# Altium project Hall.PrjPcb
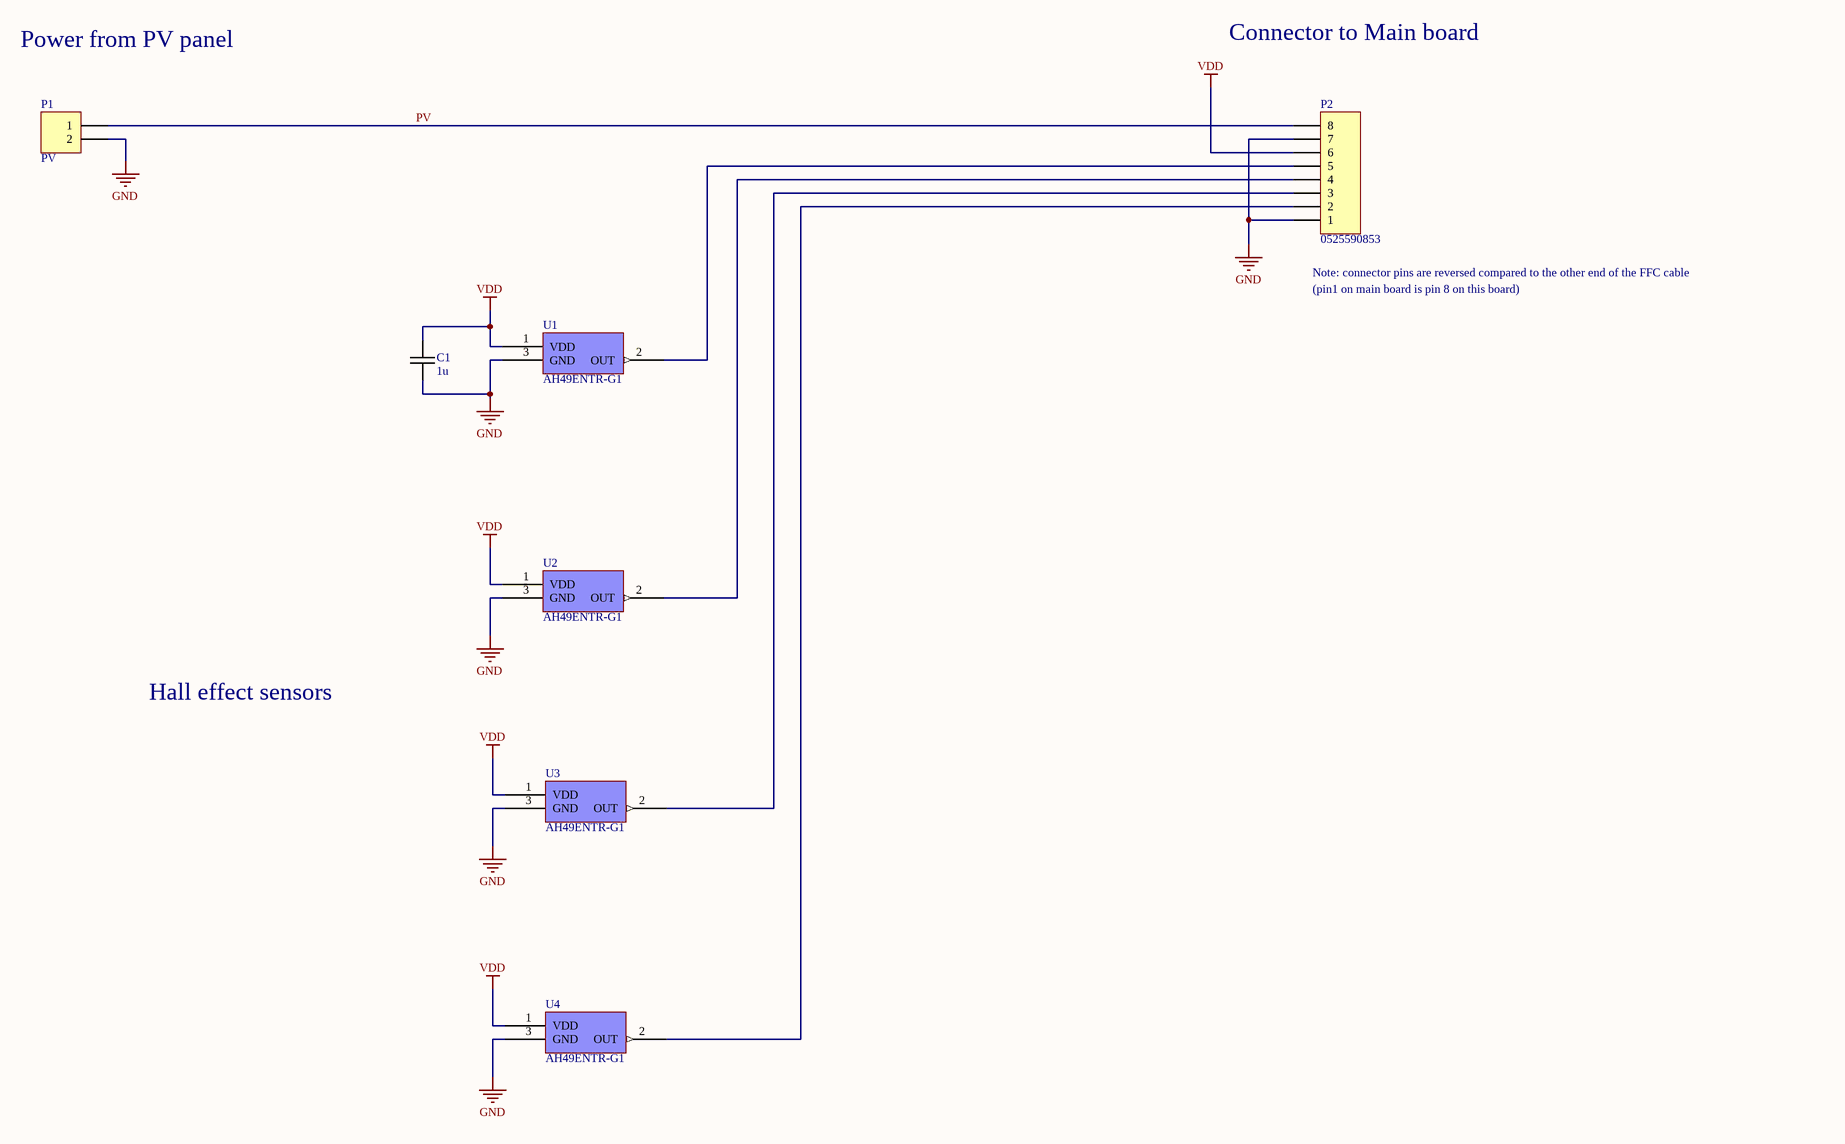
[diagram p0: hall.SchDoc]
1 sheet, 7 parts. Net scope: global (net labels, ports and power ports of the same name join across sheets).
Board file: hall.PcbDoc

## Sheet hall.SchDoc: Halls
size Tabloid; Author: Martin Lafleur; DrawnBy: Martin Lafleur; Organization: OpenSolar; Address1: www.opensolar.io; ProjectName: OpenOne

### Parts
C1  1u  [0805C-TBD]
P1  PV  [HEADER-1X2]
P2  0525590853  [FFC_8]
U1  AH49ENTR-G1  [SOT23_AH49E]
U2  AH49ENTR-G1  [SOT23_AH49E]
U3  AH49ENTR-G1  [SOT23_AH49E]
U4  AH49ENTR-G1  [SOT23_AH49E]

### Nets
GND: C1.2 P1.2 P2.1 P2.7 U1.3(GND) U2.3(GND) U3.3(GND) U4.3(GND)
VDD: C1.1 P2.6 U1.1(VDD) U2.1(VDD) U3.1(VDD) U4.1(VDD)
PV: P1.1 P2.8
NetP2_2: P2.2 U4.2(OUT)
NetP2_3: P2.3 U3.2(OUT)
NetP2_4: P2.4 U2.2(OUT)
NetP2_5: P2.5 U1.2(OUT)

### Notes on the sheet
- Power from PV panel
- Connector to Main board
- (near P2) Note: connector pins are reversed compared to the other end of the FFC cable
- (pin1 on main board is pin 8 on this board)
- Hall effect sensors
- Title
- Size:
- Date:
- Tabloid
- Author:
- Time:
- Revision:
- Sheet
- of
- File:

### Library data of the parts
C1 = 0805C-TBD: CAPACITOR 0805 CERAMIC VALUE TO BE DETERMINED
P1 = Header 2: Header, 2-Pin; LatestRevisionDate: 17-Jul-2002; LatestRevisionNote: Re-released for DXP Platform.; Publisher: Altium Limited
P2 = Header 8: Header, 8-Pin; LatestRevisionDate: 17-Jul-2002; LatestRevisionNote: Re-released for DXP Platform.; Publisher: Altium Limited
U1-U4 = SI7211-B-00: Hall effect analog sensor